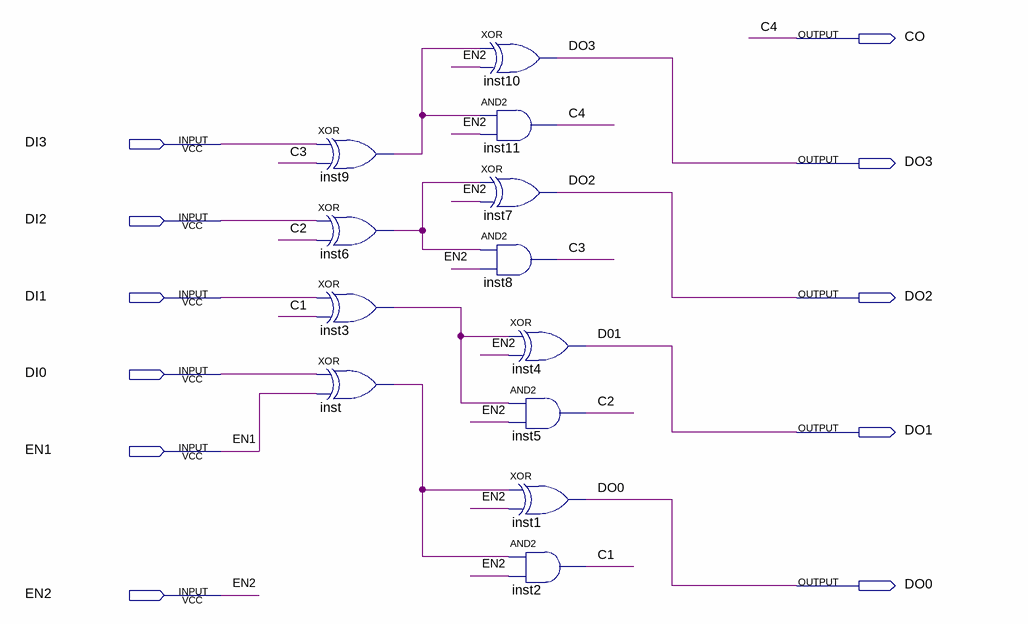
[diagram p0: schematic sheet]
// Quartus schematic Krets_12.bdf as structural Verilog: 12 symbols, 11 pins
module Krets_12 (
  input  DI3,
  input  DI2,
  input  DI1,
  input  DI0,
  input  EN1,
  input  EN2,
  output CO,
  output DO3,
  output DO2,
  output DO1,
  output DO0
);

  wire C1, C2, C3, inst3_out, inst6_out, inst9_out, inst_out;

  xor inst9 (inst9_out, DI3, C3);
  xor inst6 (inst6_out, DI2, C2);
  xor inst3 (inst3_out, DI1, C1);
  xor inst (inst_out, DI0, EN1);
  xor inst10 (DO3, inst9_out, EN2);
  and inst11 (CO, inst9_out, EN2);
  xor inst7 (DO2, inst6_out, EN2);
  and inst8 (C3, inst6_out, EN2);
  xor inst4 (DO1, inst3_out, EN2);
  and inst5 (C2, inst3_out, EN2);
  xor inst1 (DO0, inst_out, EN2);
  and inst2 (C1, inst_out, EN2);

  // Other names for the same wires on the sheet: C4 = CO; D01 = DO1
endmodule
